# EAGLE design DC_DC_self_powerd (EAGLE 6.5.0)
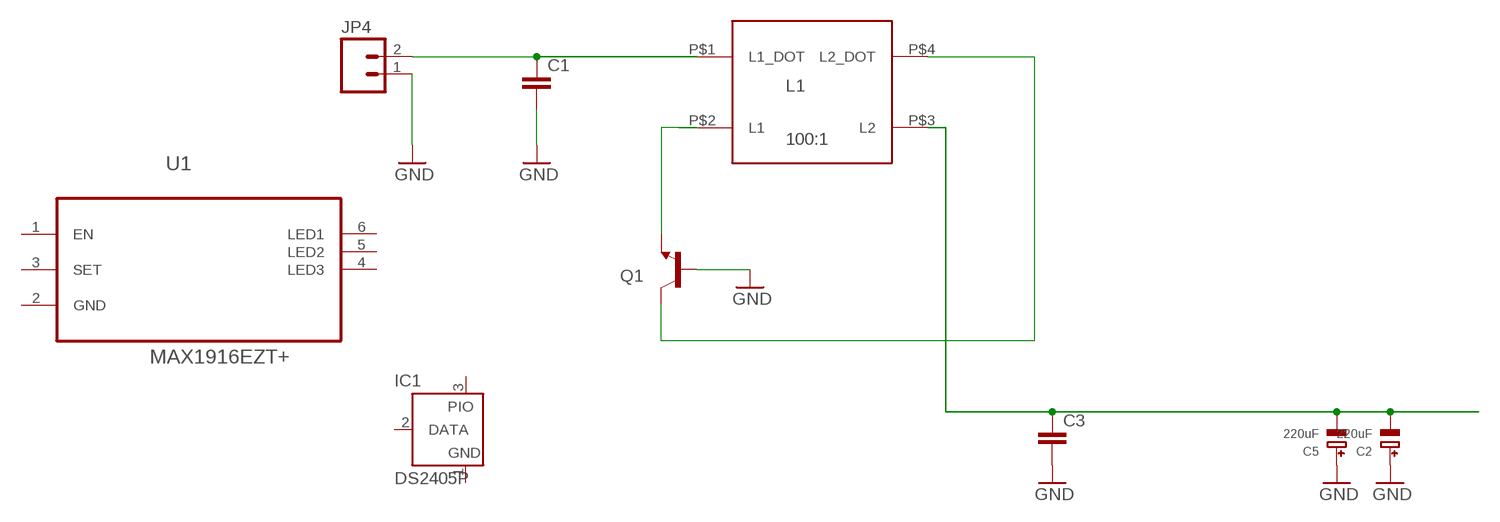
[diagram p0: schematic, sheet 1]

## Parts
C1  CAP0805  [0805]
C2  220uF  CAP_TANTALUMD/7343_REFLOW  [EIA7343-31/D-R]
C3  CAP0805  [0805]
C5  220uF  CAP_TANTALUMD/7343_REFLOW  [EIA7343-31/D-R]
IC1  DS2405P  [TSOC6]
JP4  M02PTH  [1X02]
L1  100:1  COILCRAFT_LPR6235-752SML  [COILCRAFT_LPR6235]
Q1  TRANSISTOR_NPNSOT23-3  [SOT23-3]
U1  MAX1916EZT+  [SOT95P280X110-6N]

## Nets
GND: C1.2 C2.+ C3.2 C5.+ JP4.1 Q1.1(B)
N$1: L1.P$4(L2_DOT) Q1.3(C)
N$2: L1.P$2(L1) Q1.2(E)
N$3: C2.- C3.1 C5.- L1.P$3(L2)
N$4: C1.1 JP4.2 L1.P$1(L1_DOT)
Unconnected: IC1.1(GND) IC1.2(DATA) IC1.3(PIO) U1.1(EN) U1.2(GND) U1.3(SET) U1.4(LED3) U1.5(LED2) U1.6(LED1)

## Library data of the parts
C1 C3 = SparkFun:CAP: Capacitor Standard 0603 ceramic capacitor, and 0.1" leaded capacitor.
C2 C5 = microbuilder:CAP_TANTALUM: Tantalum Capacitors Wave footprints have larger pads and are meant to be used for hand soldering. Reflow footprints are optimised for solder paste and a reflow oven. EIA3216-18/A-[R/W] - Size A / 3216-18 / 1206 footprint 4.7µF 25V 10% Tantalum Capacitor 10µF 16V 10% Tantalum Capacitor [Digikey: 495-2236-2-ND] EIA3528-21/B-[R/W] - Size B / 3528-21 47µF 10V 10% Tantalum Capactior [Digikey: 495-2216-1-ND] EIA6032-28/C-[R/W] - Size C / 6032-28 10µF 35V 20% Tantalum Capacitor [Digikey: 495-2285-1-ND] 100µF 16V 10% Tantalum Capactior [Digikey: 399-5214-1-ND]
IC1 = maxim:DS2405: Addressable Switch DALLAS Semiconductor; OC_FARNELL: unknown; OC_NEWARK: unknown
JP4 = SparkFun:M02: Header 2 Standard 2-pin 0.1" header. Use with straight break away headers (SKU : PRT-00116), right angle break away headers (PRT-00553), swiss pins (PRT-00743), machine pins (PRT-00117), and female headers (PRT-00115). Molex polarized connector foot print use with SKU : PRT-08233 with associated crimp pins and housings.
L1 = wa7iut:COILCRAFT_LPR6235-752SML: Coil Craft LPR6235-752SML
Q1 = SparkFun:TRANSISTOR_NPN: Transistor NPN BJT configuration in SOT23 package. MMBT2222 is the common NPN we use. Double check BCE configuration again layout.
U1 = Maxim_By_element14_Batch_1:MAX1916EZT+: Low-Dropout, Constant-Current Triple White LED Bias Supply; MPN: MAX1916EZT+; OC_FARNELL: -; OC_NEWARK: 06R2283; PACKAGE: SOT23-6; SUPPLIER: Maxim

## Board
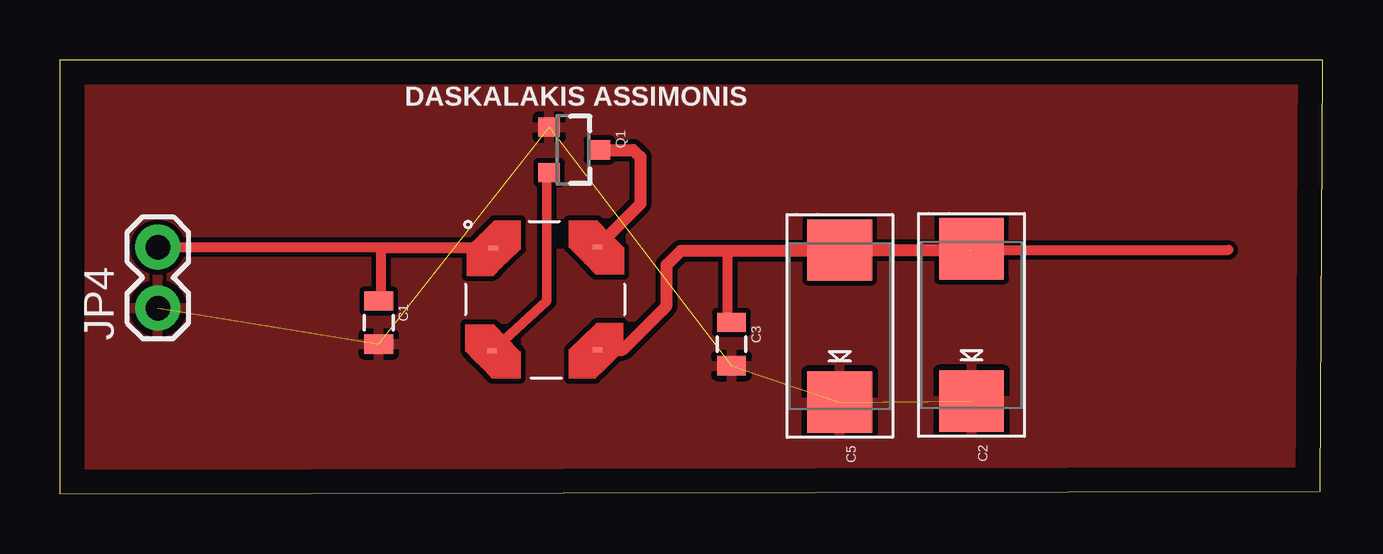
[diagram p1: board, top side]

Size 52.61 x 18.09 mm. Coordinates in mm from the lower left corner, seen from the top.
Outline: 0,0 52.51,0.1 52.61,18.09 0,18.09 0,0
Copper layers (1*16): Top 0.035mm / dielectric 1.5mm / Bottom 0.035mm
Design rules "default": minimum track width 10mil, minimum drill 24mil, track to track 8mil, track to pad 8mil, pad to pad 8mil, via to via 8mil, smd to smd 8mil, copper to edge 40mil, drill to drill 8mil, minimum pad ring 10mil, minimum via ring 8mil, stop-mask expansion 4mil, vias tented up to drill 0mil, thermal gap 10mil

### Footprints (pad centres in the part's own frame; a part is rotated, then mirrored left to right if it is on the bottom)
0805 = smd 0.8 x 1.2: 1 -0.9,0; 2 0.9,0
EIA7343-31/D-R = smd 2.55 x 2.7: + 3.175,0; - -3.175,0
1X02 = drill 1.016 pad 1.88: 1 0,0; 2 2.54,0
COILCRAFT_LPR6235 = smd 0.406 x 0.203: P$1 -2.15,2.15; P$2 -2.2,-2.15; P$3 2.2,-2.1; P$4 2.2,2.2
SOT23-3 = smd 0.8 x 0.9: 1 -0.95,-1; 2 0.95,-1; 3 0,1.1

### Placement (x,y rotation side)
C1  13.28,7.14 270 top
C2  37.98,7.04 270 top
C3  27.98,6.24 270 top
C5  32.49,6.99 270 top
JP4  4.08,7.74 90 top
L1  20.2,8.1 0 top
Q1  21.38,14.34 270 top

### Tracks (layer width: path | path; a pad name or v marks a point on that pad's centre or on a via)
GND  (5 unrouted)
  pour Top: -5.81,20.27 63.13,20.37 62.36,-10.54 -5.78,-10.24
N$1
  Top 0.5: Q1.3 23.88,14.34 24.18,14.04 24.18,12.08 L1.P$4
N$2
  Top 0.4: L1.P$2 20.28,8.04 20.28,13.09 Q1.2
N$3  (1 unrouted)
  Top 0.406: C3.1 27.83,7.14 27.83,10.14 | 37.91,10.17 48.68,10.17
  Top 0.5: L1.P$3 23.44,6 25.28,7.84 25.28,9.54 25.88,10.14 27.83,10.14 32.98,10.14 32.98,10.17 | 33.03,10.09 33.18,10.24 32.56,10.24 C5.- 32.98,10.17 | 32.98,10.17 37.91,10.17
N$4
  Top 0.406: JP4.2 18.05,10.28 L1.P$1 13.38,10.24 13.38,8.04 C1.1

### Text on the board
tPlace: DASKALAKIS ASSIMONIS